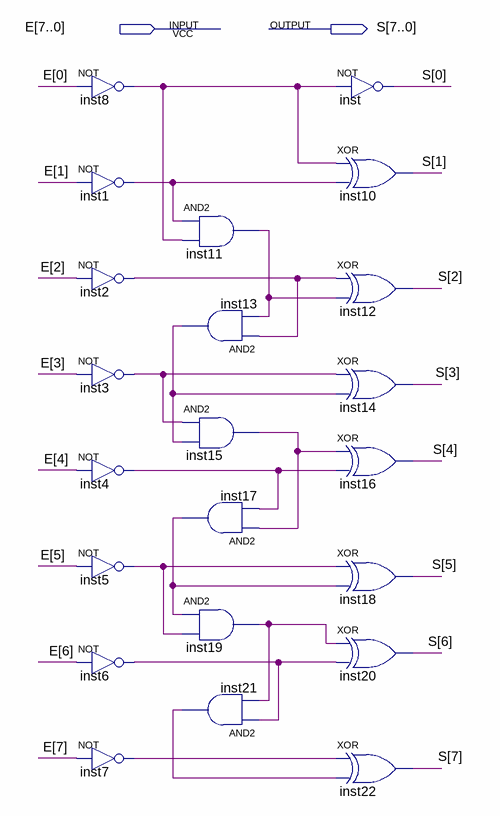
[diagram p0: schematic sheet]
// Quartus schematic signInv8b.bdf as structural Verilog: 22 symbols, 2 pins
module signInv8b (
  input  [7:0] E,
  output [7:0] S
);

  wire inst1_out, inst2_out, inst3_out, inst4_out, inst5_out, inst6_out, inst7_out, inst8_out, inst11_out,
       inst13_out, inst15_out, inst17_out, inst19_out, inst21_out;

  not inst8 (inst8_out, E[0]);
  not inst1 (inst1_out, E[1]);
  not inst2 (inst2_out, E[2]);
  not inst3 (inst3_out, E[3]);
  not inst4 (inst4_out, E[4]);
  not inst5 (inst5_out, E[5]);
  not inst6 (inst6_out, E[6]);
  not inst7 (inst7_out, E[7]);
  and inst11 (inst11_out, inst1_out, inst8_out);
  and inst13 (inst13_out, inst2_out, inst11_out);
  and inst15 (inst15_out, inst3_out, inst13_out);
  and inst17 (inst17_out, inst15_out, inst4_out);
  and inst19 (inst19_out, inst17_out, inst5_out);
  and inst21 (inst21_out, inst6_out, inst19_out);
  not inst (S[0], inst8_out);
  xor inst10 (S[1], inst8_out, inst1_out);
  xor inst12 (S[2], inst2_out, inst11_out);
  xor inst14 (S[3], inst3_out, inst13_out);
  xor inst16 (S[4], inst15_out, inst4_out);
  xor inst18 (S[5], inst5_out, inst17_out);
  xor inst20 (S[6], inst19_out, inst6_out);
  xor inst22 (S[7], inst7_out, inst21_out);
endmodule
